# EAGLE design hp16555 adapter (EAGLE 9.4.2)
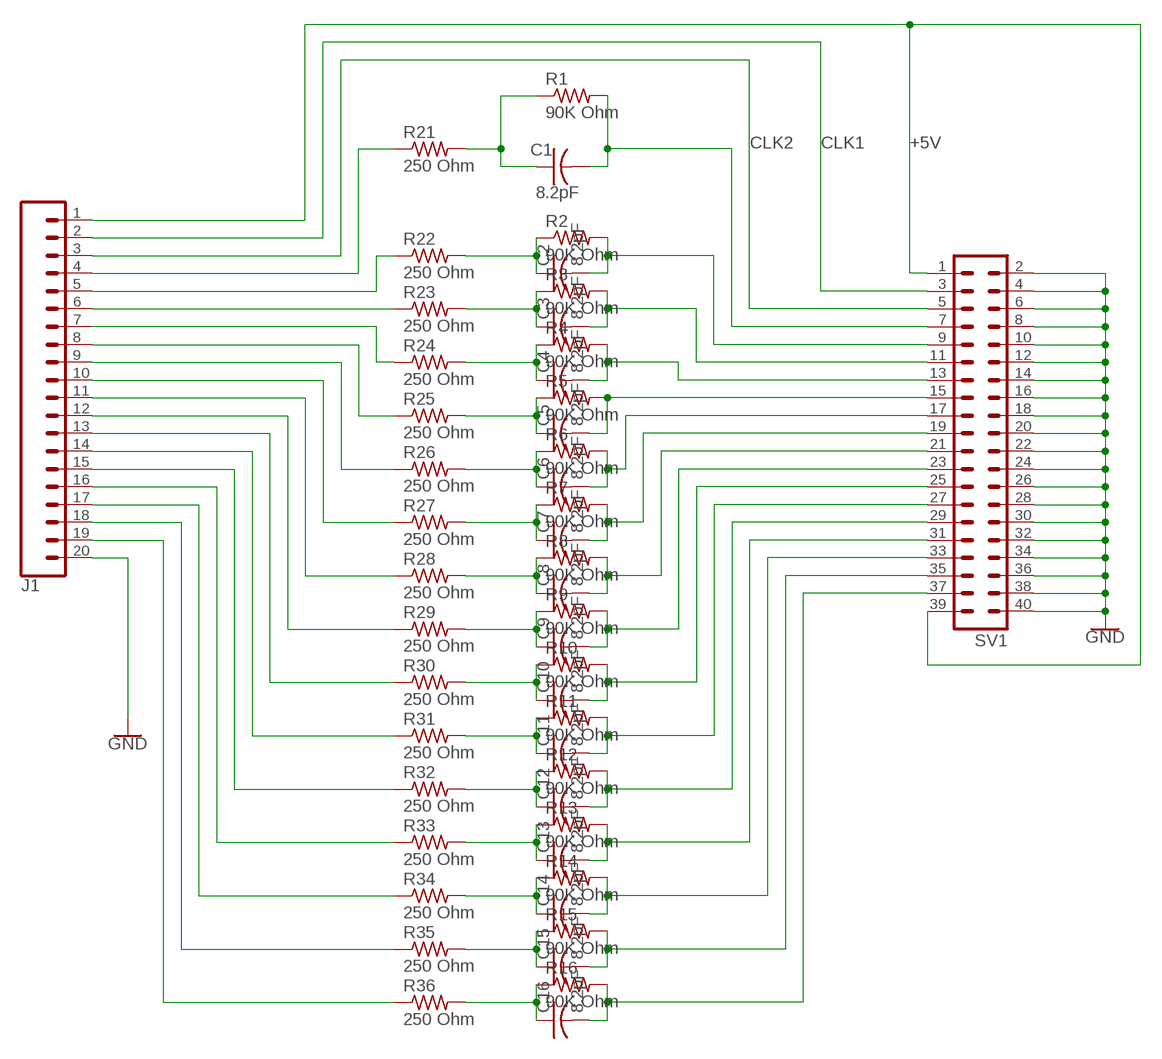
[diagram p0: schematic, sheet 1]

## Parts
C1  8.2pF  C-USC1206  [C1206]
C2  8.2pF  C-USC1206  [C1206]
C3  8.2pF  C-USC1206  [C1206]
C4  8.2pF  C-USC1206  [C1206]
C5  8.2pF  C-USC1206  [C1206]
C6  8.2pF  C-USC1206  [C1206]
C7  8.2pF  C-USC1206  [C1206]
C8  8.2pF  C-USC1206  [C1206]
C9  8.2pF  C-USC1206  [C1206]
C10  8.2pF  C-USC1206  [C1206]
C11  8.2pF  C-USC1206  [C1206]
C12  8.2pF  C-USC1206  [C1206]
C13  8.2pF  C-USC1206  [C1206]
C14  8.2pF  C-USC1206  [C1206]
C15  8.2pF  C-USC1206  [C1206]
C16  8.2pF  C-USC1206  [C1206]
J1  CONN_20  [1X20]
R1  90K Ohm  R-US_M1206  [M1206]
R2  90K Ohm  R-US_M1206  [M1206]
R3  90K Ohm  R-US_M1206  [M1206]
R4  90K Ohm  R-US_M1206  [M1206]
R5  90K Ohm  R-US_M1206  [M1206]
R6  90K Ohm  R-US_M1206  [M1206]
R7  90K Ohm  R-US_M1206  [M1206]
R8  90K Ohm  R-US_M1206  [M1206]
R9  90K Ohm  R-US_M1206  [M1206]
R10  90K Ohm  R-US_M1206  [M1206]
R11  90K Ohm  R-US_M1206  [M1206]
R12  90K Ohm  R-US_M1206  [M1206]
R13  90K Ohm  R-US_M1206  [M1206]
R14  90K Ohm  R-US_M1206  [M1206]
R15  90K Ohm  R-US_M1206  [M1206]
R16  90K Ohm  R-US_M1206  [M1206]
R21  250 Ohm  R-US_M1206  [M1206]
R22  250 Ohm  R-US_M1206  [M1206]
R23  250 Ohm  R-US_M1206  [M1206]
R24  250 Ohm  R-US_M1206  [M1206]
R25  250 Ohm  R-US_M1206  [M1206]
R26  250 Ohm  R-US_M1206  [M1206]
R27  250 Ohm  R-US_M1206  [M1206]
R28  250 Ohm  R-US_M1206  [M1206]
R29  250 Ohm  R-US_M1206  [M1206]
R30  250 Ohm  R-US_M1206  [M1206]
R31  250 Ohm  R-US_M1206  [M1206]
R32  250 Ohm  R-US_M1206  [M1206]
R33  250 Ohm  R-US_M1206  [M1206]
R34  250 Ohm  R-US_M1206  [M1206]
R35  250 Ohm  R-US_M1206  [M1206]
R36  250 Ohm  R-US_M1206  [M1206]
SV1  MA20-2  [MA20-2]

## Nets
+5V: J1.1 SV1.1 SV1.39
CLK1: J1.2 SV1.3
CLK2: J1.3 SV1.5
D0: C16.2 R16.2 SV1.37
D0-I: J1.19 R36.1
D1: C15.2 R15.2 SV1.35
D1-I: J1.18 R35.1
D2: C14.2 R14.2 SV1.33
D2-I: J1.17 R34.1
D3: C13.2 R13.2 SV1.31
D3-I: J1.16 R33.1
D4: C12.2 R12.2 SV1.29
D4-I: J1.15 R32.1
D5: C11.2 R11.2 SV1.27
D5-I: J1.14 R31.1
D6: C10.2 R10.2 SV1.25
D6-I: J1.13 R30.1
D7: C9.2 R9.2 SV1.23
D7-I: J1.12 R29.1
D8: C8.2 R8.2 SV1.21
D8-I: J1.11 R28.1
D9: C7.2 R7.2 SV1.19
D9-I: J1.10 R27.1
D10: C6.2 R6.2 SV1.17
D10-I: J1.9 R26.1
D11: C5.2 R5.2 SV1.15
D11-I: J1.8 R25.1
D12: C4.2 R4.2 SV1.13
D12-I: J1.7 R24.1
D13: C3.2 R3.2 SV1.11
D13-I: J1.6 R23.1
D14: C2.2 R2.2 SV1.9
D14-I: J1.5 R22.1
D15: C1.2 R1.2 SV1.7
D15-I: J1.4 R21.1
GND: J1.20 SV1.2 SV1.4 SV1.6 SV1.8 SV1.10 SV1.12 SV1.14 SV1.16 SV1.18 SV1.20 SV1.22 SV1.24 SV1.26 SV1.28 SV1.30 SV1.32 SV1.34 SV1.36 SV1.38 SV1.40
N$25: C16.1 R16.1 R36.2
N$26: C15.1 R15.1 R35.2
N$27: C14.1 R14.1 R34.2
N$28: C13.1 R13.1 R33.2
N$29: C12.1 R12.1 R32.2
N$30: C11.1 R11.1 R31.2
N$31: C10.1 R10.1 R30.2
N$32: C9.1 R9.1 R29.2
N$33: C8.1 R8.1 R28.2
N$34: C7.1 R7.1 R27.2
N$35: C6.1 R6.1 R26.2
N$36: C5.1 R5.1 R25.2
N$37: C4.1 R4.1 R24.2
N$38: C3.1 R3.1 R23.2
N$39: C2.1 R2.1 R22.2
N$40: C1.1 R1.1 R21.2

## Library data of the parts
C1-C16 = resistor:C-US: CAPACITOR, American symbol
J1 = SparkFun-Connectors:CONN_20: Multi connection point. Often used as Generic Header-pin footprint for 0.1 inch spaced/style header connections On any of the 0.1 inch spaced packages, you can populate with these: Break Away Headers - Straight <https://www.sparkfun.com/products/116> (PRT-00116) Break Away Male Headers - Right Angle <https://www.sparkfun.com/products/553> (PRT-00553) Female Headers <https://www.sparkfun.com/products/115> (PRT-00115) Break Away Headers - Machine Pin <https://www.sparkfun.com/products/117> (PRT-00117) Break Away Female Headers - Swiss Machine Pin <https://www.sparkfun.com/products/743> (PRT-00743) For SCREWTERMINALS and SPRING TERMINALS visit here: Screw Terimnals on SparkFun.com <https://www.sparkfun.com/search/results?term=Screw+Terminals> (5mm/3.5mm/2.54mm spacing) This device is also useful as a general connection point to wire up your design to another part of your project. Our various solder wires solder well into these plated through hole pads. Hook-Up Wire - Assortment (Stranded, 22 AWG) <https://www.sparkfun.com/products/11375> (PRT-11375) Hook-Up Wire - Assortment (Solid Core, 22 AWG) <https://www.sparkfun.com/products/11367> (PRT-11367) View the entire wire category on our website here <https://www.sparkfun.com/categories/141> Special notes: Molex polarized connector foot print use with SKU : PRT-08231 with associated crimp pins and housings. 1MM SMD Version SKU: PRT-10208 NOTES ON THE VARIANTS LOCK and LOCK_LONGPADS... This footprint was designed to help hold the alignment of a through-hole component (i.e. 6-pin header) while soldering it into place. You may notice that each hole has been shifted either up or down by 0.005 of an inch from it's more standard position (which is a perfectly straight line). This slight alteration caused the pins (the squares in the middle) to touch the edges of the holes. Because they are alternating, it causes a "brace" to hold the component in place. 0.005 has proven to be the perfect amount of "off-center" position when using our standard breakaway headers. Although looks a little odd when you look at the bare footprint, once you have a header in there, the alteration is very hard to notice. Also,if you push a header all the way into place, it is covered up entirely on the bottom side. Note about LOCK SPECIAL package: This is just like the LOCK variant in that the holes are staggared by 5 mil, but except for the last two holes. They are not altered from the "standard" footprint layout. This is used for a special purpose on the layout of our Graphic LCD Backpack. Make sure you want to use this device before selecting it for you project!
R1-R16 R21-R36 = resistor:R-US_: RESISTOR, American symbol
SV1 = con-lstb:MA20-2: PIN HEADER; OC_FARNELL: unknown; OC_NEWARK: unknown

## Board
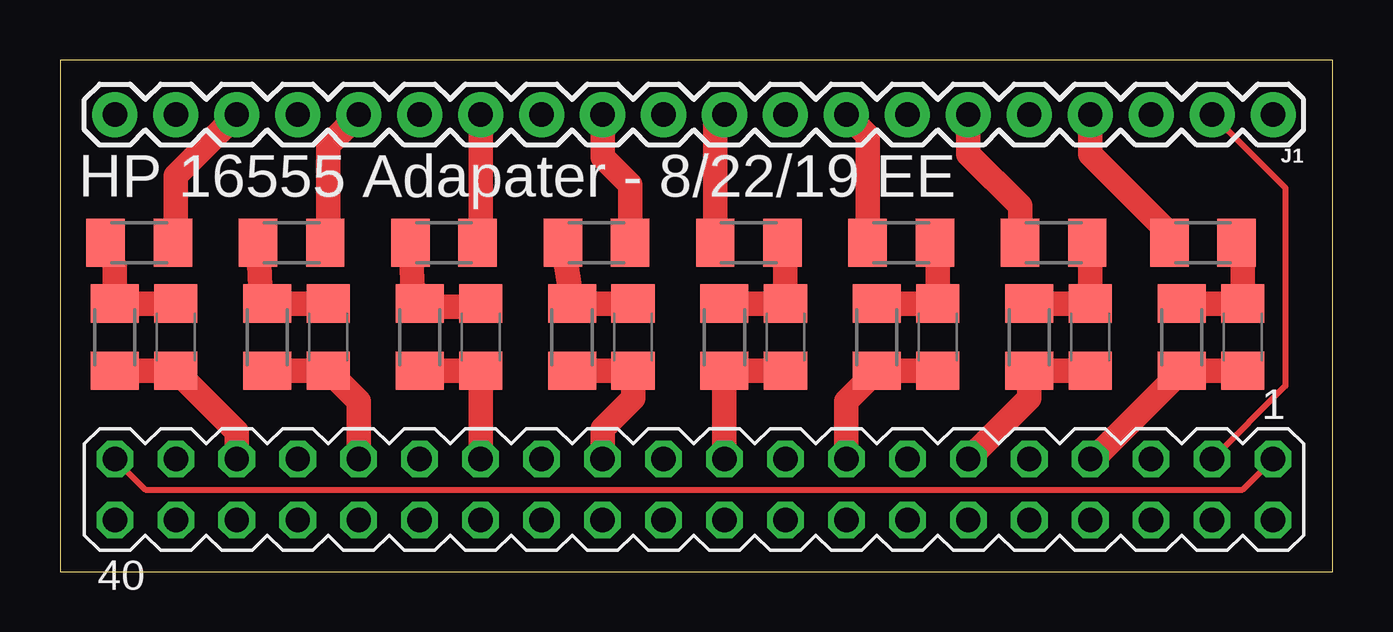
[diagram p1: board, top side]
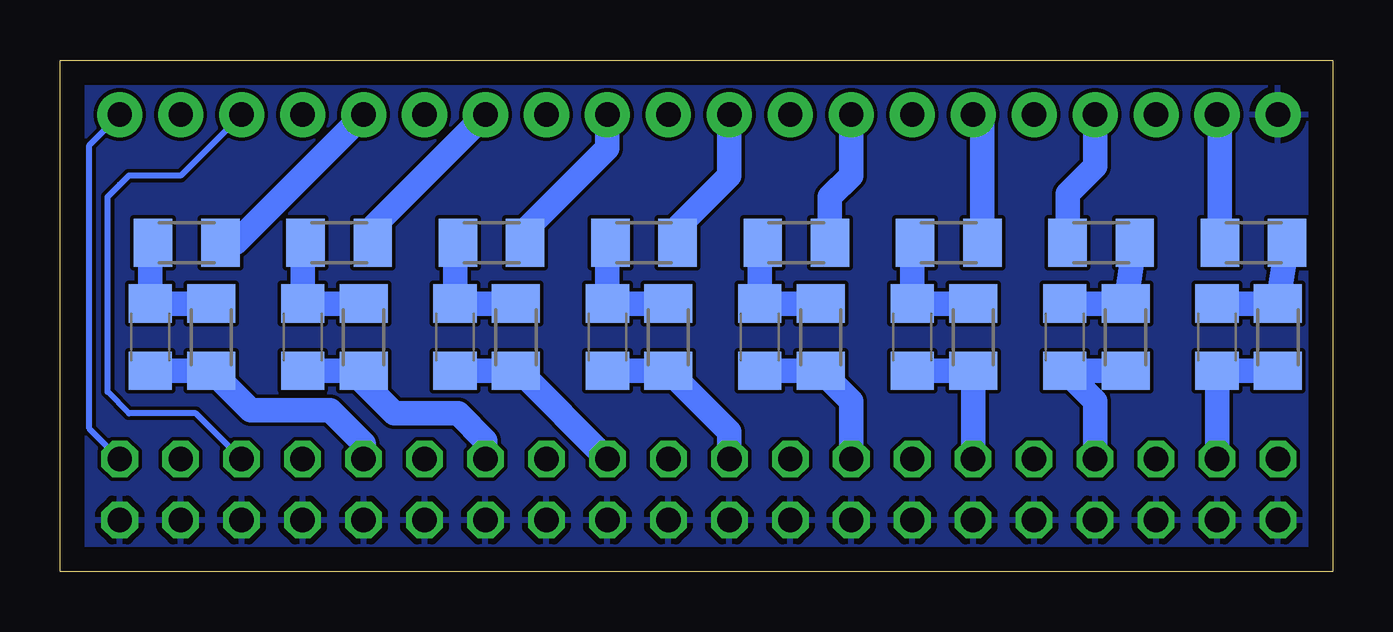
[diagram p2: board, bottom side, seen from below]

Size 53.03 x 21.33 mm. Coordinates in mm from the lower left corner, seen from the top.
Outline: 0,0 53.03,0 53.03,21.33 0,21.33 0,0
Copper layers (1*16): Top 0.035mm / dielectric 1.5mm / Bottom 0.035mm
Design rules "default": minimum track width 6mil, minimum drill 0.35mm, track to track 6mil, track to pad 6mil, pad to pad 6mil, via to via 6mil, smd to smd 6mil, copper to edge 40mil, drill to drill 6mil, minimum pad ring 10mil, minimum via ring 8mil, stop-mask expansion 4mil, vias tented up to drill 0mil, thermal gap 10mil

### Footprints (pad centres in the part's own frame; a part is rotated, then mirrored left to right if it is on the bottom)
C1206 = smd 1.6 x 1.8: 1 -1.4,0; 2 1.4,0
1X20 = drill 1.016 pad 1.88: 1 0,0; 2 2.54,0; 3 5.08,0; 4 7.62,0; 5 10.16,0; 6 12.7,0; 7 15.24,0; 8 17.78,0; 9 20.32,0; 10 22.86,0; 11 25.4,0; 12 27.94,0; 13 30.48,0; 14 33.02,0; 15 35.56,0; 16 38.1,0; 17 40.64,0; 18 43.18,0; 19 45.72,0; 20 48.26,0
M1206 = smd 1.6 x 2: 1 -1.4,0; 2 1.4,0
MA20-2 = drill 1.016 octagon: 1 -24.13,-1.27; 2 -24.13,1.27; 3 -21.59,-1.27; 4 -21.59,1.27; 5 -19.05,-1.27; 6 -19.05,1.27; 7 -16.51,-1.27; 8 -16.51,1.27; 9 -13.97,-1.27; 10 -13.97,1.27; 11 -11.43,-1.27; 12 -11.43,1.27; 13 -8.89,-1.27; 14 -8.89,1.27; 15 -6.35,-1.27; 16 -6.35,1.27; 17 -3.81,-1.27; 18 -3.81,1.27; 19 -1.27,-1.27; 20 -1.27,1.27; 21 1.27,-1.27; 22 1.27,1.27; 23 3.81,-1.27; 24 3.81,1.27; 25 6.35,-1.27; 26 6.35,1.27; 27 8.89,-1.27; 28 8.89,1.27; 29 11.43,-1.27; 30 11.43,1.27; 31 13.97,-1.27; 32 13.97,1.27; 33 16.51,-1.27; 34 16.51,1.27; 35 19.05,-1.27; 36 19.05,1.27; 37 21.59,-1.27; 38 21.59,1.27; 39 24.13,-1.27; 40 24.13,1.27

### Placement (x,y rotation side)
C1  49.28,9.78 270 top
C2  49.28,9.78 270 bottom
C3  42.93,9.78 270 top
C4  42.93,9.78 270 bottom
C5  36.58,9.78 270 top
C6  36.58,9.78 270 bottom
C7  30.23,9.78 270 top
C8  30.23,9.78 270 bottom
C9  23.88,9.78 270 top
C10  23.88,9.78 270 bottom
C11  17.53,9.78 270 top
C12  17.53,9.78 270 bottom
C13  11.18,9.78 270 top
C14  11.18,9.78 270 bottom
C15  4.83,9.78 270 top
C16  4.83,9.78 270 bottom
J1  50.55,19.05 180 top
R1  46.74,9.78 270 top
R2  46.74,9.78 270 bottom
R3  40.39,9.78 270 top
R4  40.39,9.78 270 bottom
R5  34.04,9.78 270 top
R6  34.04,9.78 270 bottom
R7  27.69,9.78 270 top
R8  27.69,9.78 270 bottom
R9  21.34,9.78 270 top
R10  21.34,9.78 270 bottom
R11  14.99,9.78 270 top
R12  14.99,9.78 270 bottom
R13  8.64,9.78 270 top
R14  8.64,9.78 270 bottom
R15  2.29,9.78 270 top
R16  2.29,9.78 270 bottom
R21  47.62,13.72 0 top
R22  47.75,13.72 180 bottom
R23  41.4,13.72 0 top
R24  41.4,13.72 180 bottom
R25  35.05,13.72 0 top
R26  35.05,13.72 180 bottom
R27  28.7,13.72 0 top
R28  28.7,13.72 180 bottom
R29  22.35,13.72 180 top
R30  22.35,13.72 180 bottom
R31  16,13.72 180 top
R32  16,13.72 180 bottom
R33  9.65,13.72 180 top
R34  9.65,13.72 0 bottom
R35  3.3,13.72 180 top
R36  3.3,13.72 0 bottom
SV1  26.42,3.43 180 top

### Tracks (layer width: path | path; a pad name or v marks a point on that pad's centre or on a via)
+5V
  Top 0.254: SV1.39 3.56,3.43 49.28,3.43 SV1.1
  Bottom 0.254: SV1.1 51.82,5.97 51.82,17.78 J1.1
CLK1
  Top 0.254: J1.2 51.05,16 51.05,7.75 SV1.3
CLK2
  Bottom 0.254: J1.3 48.01,16.51 50.16,16.51 50.55,16.13 51.05,15.62 51.05,7.49 50.16,6.6 47.37,6.6 SV1.5
D0
  Bottom 1.016: R16.2 C16.2 SV1.37
D0-I
  Bottom 1.016: R36.1 4.7,18.93 J1.19
D1
  Top 1.016: R15.2 C15.2 7.37,5.84 SV1.35
D1-I
  Top 1.016: R35.1 4.83,13.84 4.83,16.51 J1.18
D2
  Bottom 1.016: R14.2 C14.2 9.91,7.11 SV1.33
D2-I
  Bottom 1.016: R34.1 11.05,15.75 9.91,16.89 J1.17
D3
  Top 1.016: SV1.31 12.45,7.11 C13.2 R13.2
D3-I
  Top 1.016: R33.1 11.18,13.84 11.18,17.78 J1.16
D4
  Bottom 1.016: C12.2 R12.2 SV1.29
D4-I
  Bottom 1.016: R32.1 14.6,18.67 J1.15
D5
  Top 1.016: R11.2 C11.2 SV1.27
D5-I
  Top 1.016: R31.1 17.53,13.84 J1.14
D6
  Bottom 1.016: SV1.25 20.07,7.11 R10.2 C10.2
D6-I
  Bottom 1.016: R30.1 20.95,15.62 20.07,16.51 J1.13
D7
  Top 1.016: R9.2 C9.2 23.88,7.24 22.61,5.97 SV1.23
D7-I
  Top 1.016: R29.1 23.75,16.13 22.61,17.27 J1.12
D8
  Bottom 1.016: C8.2 R8.2 25.15,5.84 SV1.21
D8-I
  Bottom 1.016: R28.1 27.3,14.35 25.15,16.51 J1.11
D9
  Top 1.016: SV1.19 R7.2 C7.2
D9-I
  Top 1.016: R27.1 27.3,18.67 J1.10
D10
  Bottom 1.016: SV1.17 33.91,8.38 R6.2 C6.2
D10-I
  Bottom 1.016: R26.1 33.65,14.23 30.23,17.65 J1.9
D11
  Top 1.016: C5.2 R5.2 32.77,7.11 SV1.15
D11-I
  Top 1.016: R25.1 33.65,18.16 J1.8
D12
  Bottom 1.016: C4.2 R4.2 40.39,7.87 39.12,6.6 36.45,6.6 35.31,5.46 SV1.13
D12-I
  Bottom 1.016: R24.1 40,14.35 J1.7
D13
  Top 1.016: SV1.11 40.39,7.24 R3.2 C3.2
D13-I
  Top 1.016: R23.1 40,15.24 37.85,17.4 J1.6
D14
  Bottom 1.016: SV1.9 40.39,5.33 41.78,6.73 45.09,6.73 R2.2 C2.2
D14-I
  Bottom 1.016: R22.1 45.72,13.72 J1.5
D15
  Top 1.016: C1.2 R1.2 43.06,4.7 SV1.7
D15-I
  Top 1.016: R21.1 46.23,14.1 42.93,17.4 J1.4
GND
  pour Bottom: 0.63,20.83 0.63,0.38 52.58,0.38 52.58,20.83
N$25
  Bottom 1.016: R36.2 R16.1 C16.1
N$26
  Top 1.016: R35.2 2.29,12.71 R15.1 C15.1
N$27
  Bottom 1.016: R34.2 R14.1 C14.1
N$28
  Top 1.016: C13.1 R13.1 8.38,11.44 R33.2
N$29
  Bottom 1.016: R12.1 C12.1 17.53,13.59 R32.2
N$30
  Top 1.016: R31.2 14.72,11.44 R11.1 15.12,11.05 17.53,11.05 C11.1
N$31
  Bottom 1.016: R10.1 C10.1 23.88,13.59 R30.2
N$32
  Top 1.016: R29.2 R9.1 C9.1
N$33
  Bottom 1.016: R8.1 C8.1 30.23,13.59 R28.2
N$34
  Top 1.016: R7.1 C7.1 30.23,13.59 R27.2
N$35
  Bottom 1.016: R6.1 C6.1 36.58,13.59 R26.2
N$36
  Top 1.016: R5.1 C5.1 36.58,13.59 R25.2
N$37
  Bottom 1.016: R4.1 C4.1 42.93,13.59 R24.2
N$38
  Top 1.016: R3.1 C3.1 42.93,13.59 R23.2
N$39
  Bottom 1.016: R2.1 C2.1 49.28,13.59 R22.2
N$40
  Top 1.016: R1.1 C1.1 49.28,13.46 R21.2

### Text on the board
tNames: HP 16555 Adapater - 8/22/19 EE